# Altium schematic sheet Conector Interfaz.SchDoc
size A4; Author: Esteban Durán Madrid; CompanyName: Universidad de Santiago de Chile; Address1: Avenida Ecuador Nº 3519; Address2: Estación Central, Santiago; Address3: Chile
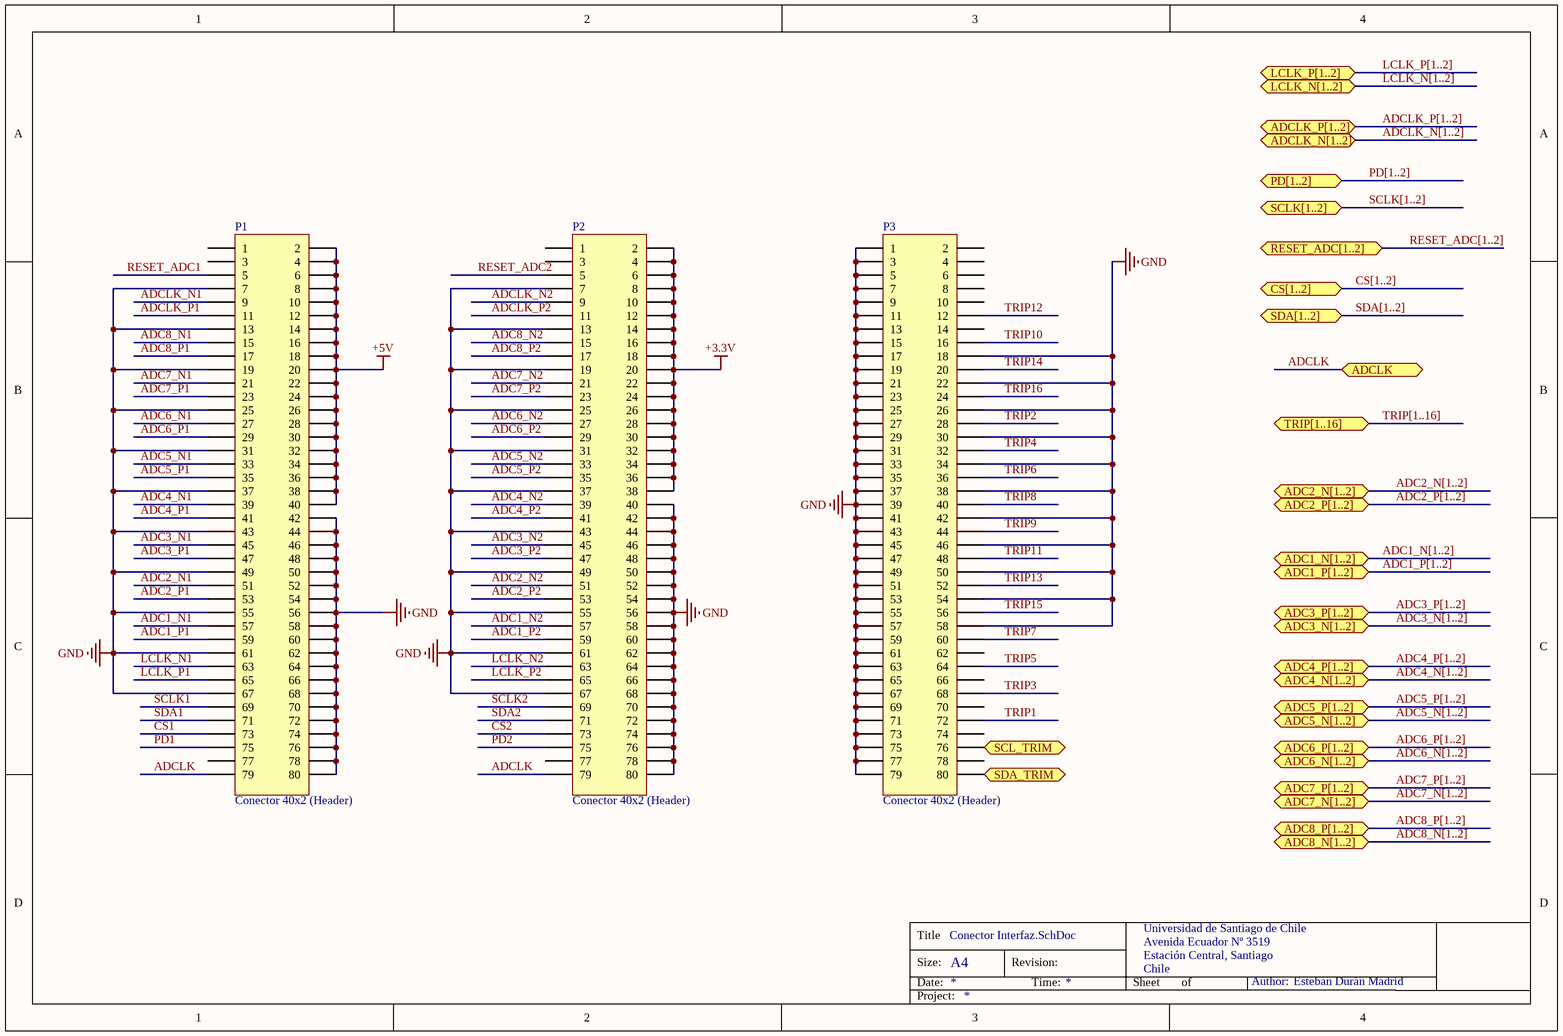
[diagram p0: Conector Interfaz.SchDoc]

## Parts
P1  Conector 40x2 (Header)  [Conector 80 Pines Hembra]
P2  Conector 40x2 (Header)  [Conector 80 Pines Hembra]
P3  Conector 40x2 (Header)  [Conector 80 Pines Hembra]

## Ports
ADC1_N[1..2] (bidir), ADC1_P[1..2] (bidir), ADC2_N[1..2] (bidir), ADC2_P[1..2] (bidir), ADC3_N[1..2] (bidir), ADC3_P[1..2] (bidir), ADC4_N[1..2] (bidir), ADC4_P[1..2] (bidir), ADC5_N[1..2] (bidir), ADC5_P[1..2] (bidir), ADC6_N[1..2] (bidir), ADC6_P[1..2] (bidir), ADC7_N[1..2] (bidir), ADC7_P[1..2] (bidir), ADC8_N[1..2] (bidir), ADC8_P[1..2] (bidir), ADCLK (bidir), ADCLK_N[1..2] (bidir), ADCLK_P[1..2] (bidir), CS[1..2] (bidir), LCLK_N[1..2] (bidir), LCLK_P[1..2] (bidir), PD[1..2] (bidir), RESET_ADC[1..2] (bidir), SCL_TRIM (bidir), SCLK[1..2] (bidir), SDA[1..2] (bidir), SDA_TRIM (bidir), TRIP[1..16] (bidir)

## Nets
+3.3V: P2.2 P2.4 P2.6 P2.8 P2.10 P2.12 P2.14 P2.16 P2.18 P2.20 P2.22 P2.24 P2.26 P2.28 P2.30 P2.32 P2.34 P2.36 P2.38
+5V: P1.2 P1.4 P1.6 P1.8 P1.10 P1.12 P1.14 P1.16 P1.18 P1.20 P1.22 P1.24 P1.26 P1.28 P1.30 P1.32 P1.34 P1.36 P1.38 P1.40
GND: P1.7 P1.13 P1.19 P1.25 P1.31 P1.37 P1.42 P1.43 P1.44 P1.46 P1.48 P1.49 P1.50 P1.52 P1.54 P1.55 P1.56 P1.58 P1.60 P1.61 P1.62 P1.64 P1.66 P1.67 P1.68 P1.70 P1.72 P1.74 P1.76 P1.78 P1.80 P2.7 P2.13 P2.19 P2.25 P2.31 P2.37 P2.40 P2.42 P2.43 P2.44 P2.46 P2.48 P2.49 P2.50 P2.52 P2.54 P2.55 P2.56 P2.58 P2.60 P2.61 P2.62 P2.64 P2.66 P2.67 P2.68 P2.70 P2.72 P2.74 P2.76 P2.78 P2.80 P3.1 P3.3 P3.5 P3.7 P3.9 P3.11 P3.13 P3.15 P3.17 P3.18 P3.19 P3.21 P3.22 P3.23 P3.25 P3.26 P3.27 P3.29 P3.30 P3.31 P3.33 P3.34 P3.35 P3.37 P3.38 P3.39 P3.41 P3.42 P3.43 P3.45 P3.46 P3.47 P3.49 P3.50 P3.51 P3.53 P3.54 P3.55 P3.57 P3.58 P3.59 P3.61 P3.63 P3.65 P3.67 P3.69 P3.71 P3.73 P3.75 P3.77 P3.79
ADC1_N1: P1.57
ADC1_N2: P2.57
ADC1_P1: P1.59
ADC1_P2: P2.59
ADC2_N1: P1.51
ADC2_N2: P2.51
ADC2_P1: P1.53
ADC2_P2: P2.53
ADC3_N1: P1.45
ADC3_N2: P2.45
ADC3_P1: P1.47
ADC3_P2: P2.47
ADC4_N1: P1.39
ADC4_N2: P2.39
ADC4_P1: P1.41
ADC4_P2: P2.41
ADC5_N1: P1.33
ADC5_N2: P2.33
ADC5_P1: P1.35
ADC5_P2: P2.35
ADC6_N1: P1.27
ADC6_N2: P2.27
ADC6_P1: P1.29
ADC6_P2: P2.29
ADC7_N1: P1.21
ADC7_N2: P2.21
ADC7_P1: P1.23
ADC7_P2: P2.23
ADC8_N1: P1.15
ADC8_N2: P2.15
ADC8_P1: P1.17
ADC8_P2: P2.17
ADCLK: P1.79 P2.79 ; port ADCLK
ADCLK_N1: P1.9
ADCLK_N2: P2.9
ADCLK_P1: P1.11
ADCLK_P2: P2.11
CS1: P1.73
CS2: P2.73
LCLK_N1: P1.63
LCLK_N2: P2.63
LCLK_P1: P1.65
LCLK_P2: P2.65
PD1: P1.75
PD2: P2.75
RESET_ADC1: P1.5
RESET_ADC2: P2.5
SCL_TRIM: P3.76 ; port SCL_TRIM
SCLK1: P1.69
SCLK2: P2.69
SDA1: P1.71
SDA2: P2.71
SDA_TRIM: P3.80 ; port SDA_TRIM
TRIP1: P3.72
TRIP2: P3.28
TRIP3: P3.68
TRIP4: P3.32
TRIP5: P3.64
TRIP6: P3.36
TRIP7: P3.60
TRIP8: P3.40
TRIP9: P3.44
TRIP10: P3.16
TRIP11: P3.48
TRIP12: P3.12
TRIP13: P3.52
TRIP14: P3.20
TRIP15: P3.56
TRIP16: P3.24

Not connected (* = marked no-connect by the designer): P1 1 3 77; P2 1 3 77; P3 2 4 6 8 10 14 62 66 70 74 78

## Buses and harness runs
bus ADC1_N[1..2] = port ADC1_N[1..2]
bus ADC1_P[1..2] = port ADC1_P[1..2]
bus ADC2_N[1..2] = port ADC2_N[1..2]
bus ADC2_P[1..2] = port ADC2_P[1..2]
bus ADC3_N[1..2] = port ADC3_N[1..2]
bus ADC3_P[1..2] = port ADC3_P[1..2]
bus ADC4_N[1..2] = port ADC4_N[1..2]
bus ADC4_P[1..2] = port ADC4_P[1..2]
bus ADC5_N[1..2] = port ADC5_N[1..2]
bus ADC5_P[1..2] = port ADC5_P[1..2]
bus ADC6_N[1..2] = port ADC6_N[1..2]
bus ADC6_P[1..2] = port ADC6_P[1..2]
bus ADC7_N[1..2] = port ADC7_N[1..2]
bus ADC7_P[1..2] = port ADC7_P[1..2]
bus ADC8_N[1..2] = port ADC8_N[1..2]
bus ADC8_P[1..2] = port ADC8_P[1..2]
bus ADCLK_N[1..2] = port ADCLK_N[1..2]
bus ADCLK_P[1..2] = port ADCLK_P[1..2]
bus CS[1..2] = port CS[1..2]
bus LCLK_N[1..2] = port LCLK_N[1..2]
bus LCLK_P[1..2] = port LCLK_P[1..2]
bus PD[1..2] = port PD[1..2]
bus RESET_ADC[1..2] = port RESET_ADC[1..2]
bus SCLK[1..2] = port SCLK[1..2]
bus SDA[1..2] = port SDA[1..2]
bus TRIP[1..16] = port TRIP[1..16]

## Notes on the sheet
- Title
- Size:
- Date:
- A4
- Revision:
- Time:
- Sheet
- of
- Author:
- Project:

## Library data of the parts
P1-P3 = Header 40X2 Hembra (Hirose): CONN RCPT 80POS 0.5MM SMD; Manufacturer Part-Number: FX20-80S-0.5SV; LatestRevisionDate: 17-Jul-2002; LatestRevisionNote: Re-released for DXP Platform.; Publisher: Altium Limited; Digikey Part-Number: H122375-ND